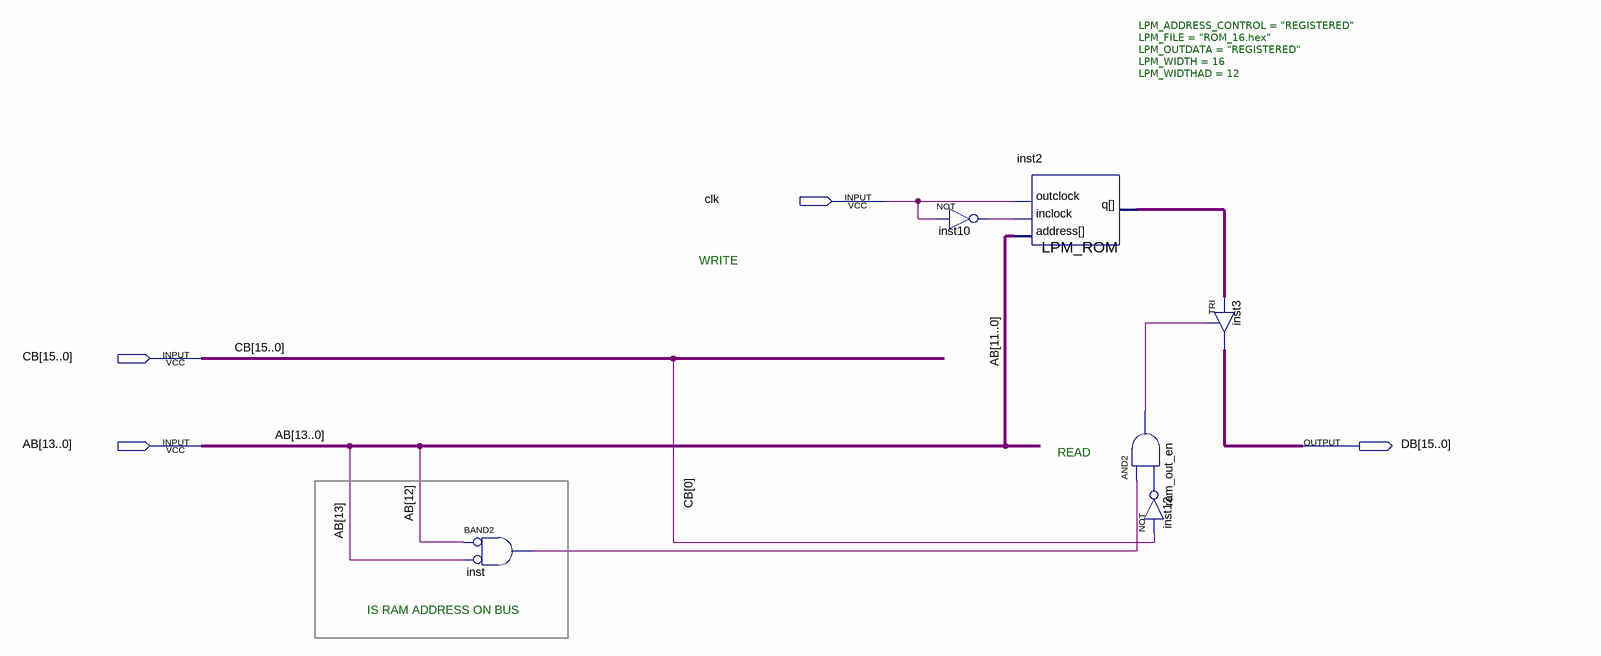
[diagram p0: schematic sheet]
// Quartus schematic ROM.bdf as structural Verilog: 6 symbols, 4 pins
module ROM (
  input  clk,
  input  [15:0] CB,
  input  [13:0] AB,
  output [15:0] DB
);

  wire inst10_out, inst12_out, inst_out, ram_out_en_out;
  wire [15:0] inst2_q;

  and inst (inst_out, ~AB[12], ~AB[13]);  // BAND2
  not inst10 (inst10_out, clk);
  LPM_ROM #(.LPM_ADDRESS_CONTROL("REGISTERED"), .LPM_FILE("ROM_16.hex"), .LPM_OUTDATA("REGISTERED"), .LPM_WIDTH(16), .LPM_WIDTHAD(12)) inst2 (
    .address(AB[11:0]), .inclock(inst10_out), .outclock(clk), .q(inst2_q));
  and ram_out_en (ram_out_en_out, inst_out, inst12_out);
  not inst12 (inst12_out, CB[0]);
  TRI inst3[15:0] (.IN(inst2_q), .OE(ram_out_en_out), .OUT(DB));

  // Notes on the sheet:
  //   WRITE
  //   READ
  //   IS RAM ADDRESS ON BUS
endmodule
